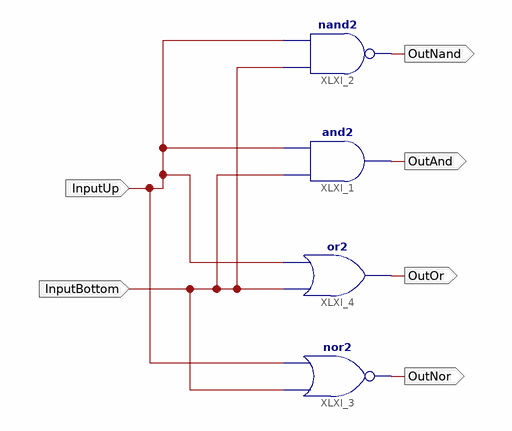
[diagram p0: schematic sheet 1]
// Xilinx ISE schematic Try1.sch (spartan3e) as structural Verilog: 4 symbols, 6 ports
module Try1 (
  input  InputUp,
  input  InputBottom,
  output OutNand,
  output OutAnd,
  output OutOr,
  output OutNor
);

  and XLXI_1 (OutAnd, InputBottom, InputUp);
  nor XLXI_3 (OutNor, InputBottom, InputUp);
  or XLXI_4 (OutOr, InputBottom, InputUp);
  nand XLXI_2 (OutNand, InputBottom, InputUp);
endmodule
